# Altium schematic sheet CFD.SchDoc: FMC_ADC
size 420 x 297 mm; Author: G.Kasprowicz; CompanyName: WUT ISE; DrawnBy: G.Kasprowicz; Organization: WUT ISE; Address1: PW ISE; Address2: Nowowiejska 15/19 00-665 Warsaw; Address3: gkasprow@gmail.com; DocumentNumber: 3; Revision: 2; SheetNumber: 3; SheetTotal: 12; ModifiedBy: -; CheckedDate: -; Title2: CFD, ADC driver; DivGrp: WUT ISE; Designer: G.Kasprowicz; ModifiedDate: -; ProjectName: Sensor Box
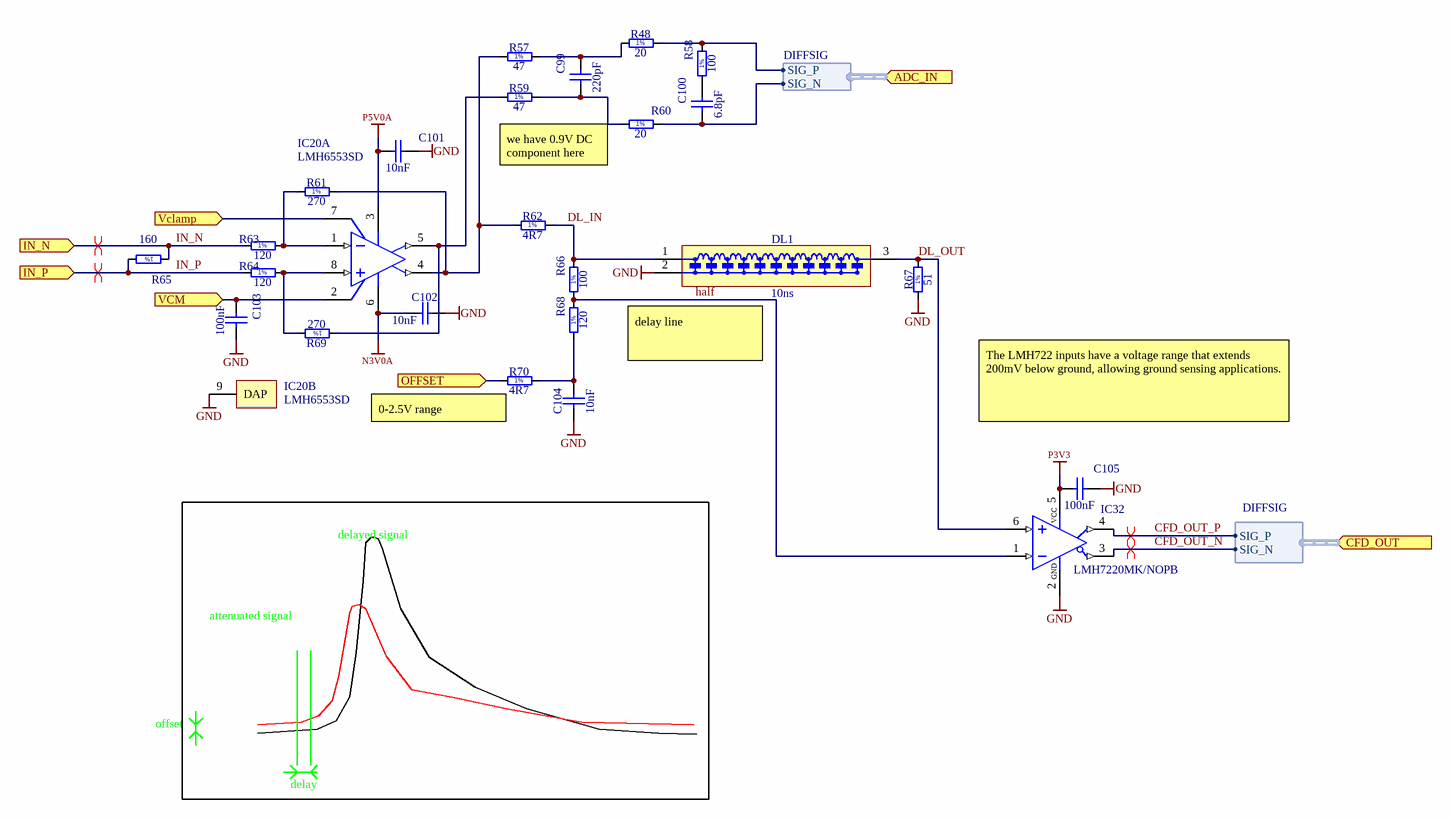
[diagram p0: CFD.SchDoc]

## Parts
C99  220pF  [CAPC1005X55N]
C100  6.8pF  [CAPC1005X70N]
C101  10nF  [CAPC0603X33N]
C102  10nF  [CAPC0603X33N]
C103  100nF  [CAPC0603X33N]
C104  10nF  [CAPC1005X55N]
C105  100nF  [CAPC0603X33N]
DL1  10ns  [DS1L]
IC20  LMH6553SD  [SDA08C]  (parts A,B of 2)
IC32  LMH7220MK/NOPB  [SOT95P285X100-6N]
R48  20  [RESC1005X40N]
R57  47  [RESC1005X40N]
R58  100  [RESC0603X28N]
R59  47  [RESC1005X40N]
R60  20  [RESC1005X40N]
R61  270  [RESC1005X40N]
R62  4R7  [RESC1005X40N]
R63  120  [RESC1005X40N]
R64  120  [RESC1005X40N]
R65  160  [RESC1005X40N]
R66  100  [RESC0603X28N]
R67  51  [RESC1005X40N]
R68  120  [RESC1005X40N]
R69  270  [RESC1005X40N]
R70  4R7  [RESC1005X40N]

## Ports
ADC_IN (in, harness DIFFSIG), CFD_OUT (in, harness DIFFSIG), IN_N (in), IN_P (in), OFFSET (in), Vclamp (in), VCM (in)

## Harnesses
DIFFSIG: SIG_P, SIG_N

## Nets
GND: C101.2 C102.2 C103.2 C104.1 C105.2 DL1.2(IN) IC20.9(DAP) IC32.2(GND) R67.1
N3V0A: C102.1 IC20.6(V-)
P3V3: C105.1 IC32.5(VCC)
P5V0A: C101.1 IC20.3(V+)
CFD_OUT_N: IC32.3(VOUT~{Q}) ; port CFD_OUT.SIG_N
CFD_OUT_P: IC32.4(VOUTQ) ; port CFD_OUT.SIG_P
DL_IN: DL1.1(GND) R62.2 R66.2
DL_OUT: DL1.3(OUT) IC32.6(IN+) R67.2
half: IC32.1(IN-) R66.1 R68.2
IN_N: R63.1 R65.1 ; port IN_N
IN_P: R64.1 R65.2 ; port IN_P
OFFSET: R70.1 ; port OFFSET
Vclamp: IC20.7(VCLAMP) ; port Vclamp
VCM: C103.1 IC20.2(VCM) ; port VCM
NetC99_1: C99.1 R59.2 R60.1
NetC99_2: C99.2 R48.1 R57.2
NetC100_1: C100.1 R60.2 ; port ADC_IN.SIG_N
NetC100_2: C100.2 R58.1
NetC104_2: C104.2 R68.1 R70.2
NetIC20_1: IC20.1(IN-) R61.1 R63.2
NetIC20_4: IC20.4(OUT+) R57.1 R61.2 R62.1
NetIC20_5: IC20.5(OUT-) R59.1 R69.1
NetIC20_8: IC20.8(IN+) R64.2 R69.2
NetR48_2: R48.2 R58.2 ; port ADC_IN.SIG_P

## Layout directives
differential pair: CFD_OUT_N, CFD_OUT_P, IN_N, IN_P

## Notes on the sheet
- we have 0.9V DC component here
- delay line
- (near R70) 0-2.5V range
- The LMH722 inputs have a voltage range that extends  200mV below ground, allowing ground sensing applications.
- delayed signal
- attenuated signal
- offset
- delay
- Project/Equipment
- Document
- Designer
- Drawn by
- Check.by
- Copyright WUT ISE 2018.
  This documentation describes Open Hardware and is licensed under the CERN OHL v.1.1. You may redistribute and modify this documentation under the terms of the CERN OHL v.1.1. (http://ohwr.org/CERNOHL). This documentation is distributed WITHOUT ANY EXPRESS OR IMPLIED WARRANTY, INCLUDING OF MERCHANTABILITY, SATISFACTORY QUALITY AND FITNESS FOR A PARTICULAR PURPOSE. Please see the CERN OHL v.1.1 for applicable conditions.
- Contact
- File
- Last Mod.
- Print Date
- Sheet
- Size
- A3
- of
- Rev
- (in symbol R0201_100R_1%_0.05W_200PPM) 1%
- (in symbol R0402_4R7_1%_0.0625W_200PPM) 1%
- (in symbol R0402_20R_1%_0.0625W_100PPM) 1%
- (in symbol R0402_47R_1%_0.0625W_100PPM) 1%
- (in symbol R0402_51R_1%_0.0625W_100PPM) 1%
- (in symbol R0402_120R_1%_0.0625W_100PPM) 1%
- (in symbol R0402_160R_1%_0.0625W_100PPM) 1%
- (in symbol R0402_270R_1%_0.0625W_100PPM) 1%

## Library data of the parts
C99 = CC0402_220PF_50V_5%_C0G: Non-polarised capacitor; Part Description: SMD Multilayer Chip Ceramic Capacitor; Manufacturer: GENERIC; Manufacturer1 Part Number: C0402C221J5GACTU; Voltage: 50V; TC: C0G/NP0; Tolerance: ±5%; Part Number: CC0402_220PF_50V_5%_C0G; Component Kind: Standard; Component Type: Standard; Pin Count: 2; Value: 220pF; Status: Preferred; Manufacturer Part Number: CC0402_220PF_50V_5%_C0G; Case: 0402; Mounted: Yes; Socket: No; SMD: Yes; Sense: No; Manufacturer1 ComponentHeight: 0.55mm; HelpURL: \\cern.ch\dfs\Applications\Altium\Datasheets\CC0805_C0G_KEMET_(Commercial Grade).pdf; Author: CERN DEM JLC; CreateDate: 03.12.2007; LatestRevisionDate: 22.04.2015; Manufacturer1 Example: KEMET
C100 = CC0402_6.8PF_50V_0.25PF_C0G_VISHAY_VJ_NON-MAGNETIC: Non-polarised capacitor; Part Description: Surface Mount Multilayer Ceramic Chip Capacitors for Non-Magnetic Applications (IR Reflow Soldering); Manufacturer: VISHAY VITRAMON; Manufacturer Part Number: VJ0402A6R8CCAA; Voltage: 50V; TC: C0G/NP0; Tolerance: ±0.25pF; Part Number: CC0402_6.8PF_50V_0.25PF_C0G_VISHAY_VJ_NON-MAGNETIC; Component Kind: Standard; Component Type: Standard; Pin Count: 2; Value: 6.8pF; Status: Not Recommended; Case: 0402; Mounted: Yes; Socket: No; SMD: Yes; Sense: No; ComponentHeight: 0.64mm; HelpURL: \\cern.ch\dfs\Applications\Altium\Datasheets\CC0402_VISHAY_VJ_NON-MAGNETIC.pdf; Author: CERN DEM MR; CreateDate: 22.06.2016; LatestRevisionDate: 03.03.2017
C101 C102 = CC0201_10NF_10V_10%_X5R: Non-polarised capacitor; Part Description: SMD Multilayer Chip Ceramic Capacitor; Manufacturer: GENERIC; Manufacturer1 Part Number: 0201ZD103KAT2A; Voltage: 10V; TC: X5R; Tolerance: ±10%; Part Number: CC0201_10NF_10V_10%_X5R; Component Kind: Standard; Component Type: Standard; Pin Count: 2; Value: 10nF; Status: Not Recommended; Manufacturer Part Number: CC0201_10NF_10V_10%_X5R; Case: 0201; Mounted: Yes; Socket: No; SMD: Yes; Sense: No; Manufacturer1 Example: AVX; Manufacturer1 ComponentHeight: 0.33mm; HelpURL: \\cern.ch\dfs\Applications\Altium\Datasheets\CC0201_X5R_AVX.pdf; Author: CERN DEM JLC; CreateDate: 03.12.2007; LatestRevisionDate: 03.12.2007
C103 C105 = CC0201_100NF_6.3V_10%_X5R: Non-polarised capacitor; Part Description: SMD Multilayer Chip Ceramic Capacitor; Manufacturer: GENERIC; Manufacturer1 Part Number: 02016D104KAT2A; Voltage: 6.3V; TC: X5R; Tolerance: ±10%; Part Number: CC0201_100NF_6.3V_10%_X5R; Component Kind: Standard; Component Type: Standard; Pin Count: 2; Value: 100nF; Status: Not Recommended; Manufacturer Part Number: CC0201_100NF_6.3V_10%_X5R; Case: 0201; Mounted: Yes; Socket: No; SMD: Yes; Sense: No; Manufacturer1 Example: AVX; Manufacturer1 ComponentHeight: 0.33mm; HelpURL: \\cern.ch\dfs\Applications\Altium\Datasheets\CC0201_X5R_AVX.pdf; Author: CERN DEM JLC; CreateDate: 03.12.2007; LatestRevisionDate: 03.12.2007
C104 = CC0402_10NF_16V_10%_X7R: Non-polarised capacitor; Part Description: SMD Multilayer Chip Ceramic Capacitor; Manufacturer: GENERIC; Manufacturer1 Part Number: 223878715636; Voltage: 16V; TC: X7R; Tolerance: ±10%; Part Number: CC0402_10NF_16V_10%_X7R; Component Kind: Standard; Component Type: Standard; Pin Count: 2; Value: 10nF; Status: Not Recommended; Manufacturer Part Number: CC0402_10NF_16V_10%_X7R; Case: 0402; Mounted: Yes; Socket: No; SMD: Yes; Sense: No; Manufacturer1 Example: PHYCOMP; Manufacturer1 ComponentHeight: 0.55mm; HelpURL: \\cern.ch\dfs\Applications\Altium\Datasheets\CC0402_X7R_PHYCOMP.pdf; Author: CERN DEM JLC; CreateDate: 03.12.2007; LatestRevisionDate: 03.12.2007
DL1 = DL_DS1L: Fixed SIP Delay Line; Part Description: 50 Ohm Fixed SIP Delay Line; Resistance: ± 1.0ns; Part Number: DS1L; Component Kind: Standard; Component Type: Standard; Pin Count: 2; Value: 10ns; Manufacturer: DS1L; Manufacturer Part Number: DS1L; Mounted: Yes; Socket: No; SMD: No; Sense: No; ComponentHeight: 9.2; HelpURL: \\cern.ch\dfs\Applications\Altium\Datasheets\DL_DATA-DELAY-DEVICES_1513.pdf; Author: GK; CreateDate: 07.05.2012; LatestRevisionDate: 07.05.2012
IC20 = CMP-0055-00983-1: 900 MHz Fully Differential Amplifier with Output Limiting Clamp, 8-pin LLP; Manufacturer: National Semiconductor; CompType: Amplifiers; PowerWise: Y; PackageTopMarking: XYTT*6553; PackageVersion: revA, Jan-2004; PackageDescription: LLP, Plastic, Dual, 2.5 x 3.0 x 0.8mm Body, 8 Lead, 0.5mm Pitch, No Pullback; PinCount: 8; PackageReference: SDA08C; DatasheetVersion: Nov-2008; RoHS: Y
IC32 = LMH7220MK/NOPB: High Speed Comparator with LVDS Output; Manufacturer: NATIONAL SEMICONDUCTOR; PressFit: No; Bonding: No; Part Number: LMH7220MK/NOPB; Component Kind: Standard; Component Type: Standard; Device: LMH7220MK/NOPB; PackageDescription: 0.95mm, pitch; 6 pin, 1.65mm W X 2.97mm L X 1.00mm H body IPC Medium Density; Part Description: High Speed Comparator with LVDS Output; Manufacturer Part Number: LMH7220MK/NOPB; Pin Count: 6; Case: SOT23-6; Mounted: Yes; Socket: No; SMD: Yes; Sense: No; ComponentHeight: 1mm; Author: CERN DEM JLC; HelpURL: \\cern.ch\dfs\Applications\Altium\Datasheets\LMH7220MK-NOPB.pdf; CreateDate: 30.03.2010; LatestRevisionDate: 30.03.2010
R48 R60 = R0402_20R_1%_0.0625W_100PPM: Resistor - 1%; Part Description: General Purpose Thick Film Chip Resistor; Manufacturer: GENERIC; Manufacturer1 Part Number: 232270672009L; TC: ±100ppm/°C; PressFit: No; Part Number: R0402_20R_1%_0.0625W_100PPM; Component Kind: Standard; Component Type: Standard; Pin Count: 2; Value: 20; Status: Not Recommended; Power: 0.0625W; Tolerance: ±1%; Manufacturer Part Number: R0402_20R_1%_0.0625W_100PPM; Case: 0402; Mounted: Yes; Sense: No; Socket: No; SMD: Yes; Manufacturer1 Example: YAGEO PHYCOMP; Manufacturer1 ComponentHeight: 0.4mm; HelpURL: \\cern.ch\dfs\Applications\Altium\Datasheets\R0402_Phycomp_RC0402.pdf; Author: CERN DEM JLC; CreateDate: 03.12.2007; LatestRevisionDate: 17.10.2012
R57 R59 = R0402_47R_1%_0.0625W_100PPM: Resistor - 1%; Part Description: General Purpose Thick Film Chip Resistor; Manufacturer: GENERIC; Manufacturer1 Part Number: 232270674709L; TC: ±100ppm/°C; PressFit: No; Part Number: R0402_47R_1%_0.0625W_100PPM; Component Kind: Standard; Component Type: Standard; Pin Count: 2; Value: 47; Status: Not Recommended; Power: 0.0625W; Tolerance: ±1%; Manufacturer Part Number: R0402_47R_1%_0.0625W_100PPM; Case: 0402; Mounted: Yes; Sense: No; Socket: No; SMD: Yes; Manufacturer1 Example: YAGEO PHYCOMP; Manufacturer1 ComponentHeight: 0.4mm; HelpURL: \\cern.ch\dfs\Applications\Altium\Datasheets\R0402_Phycomp_RC0402.pdf; Author: CERN DEM JLC; CreateDate: 03.12.2007; LatestRevisionDate: 17.10.2012
R58 R66 = R0201_100R_1%_0.05W_200PPM: Resistor - 1%; Part Description: Thick Film Chip Resistor; Manufacturer: GENERIC; Manufacturer1 Part Number: CRCW0201100RFNED; Power: 0.05W; TC: ±200ppm/°C; PressFit: No; Part Number: R0201_100R_1%_0.05W_200PPM; Component Kind: Standard; Component Type: Standard; Pin Count: 2; Value: 100; Status: Not Recommended; Tolerance: ±1%; Manufacturer Part Number: R0201_100R_1%_0.05W_200PPM; Case: 0201; Mounted: Yes; Sense: No; Socket: No; SMD: Yes; Manufacturer1 Example: VISHAY; Manufacturer1 ComponentHeight: 0.27mm; HelpURL: \\cern.ch\dfs\Applications\Altium\Datasheets\R0201_VISHAY_CRCW0201 e3.pdf; Author: CERN DEM JLC; CreateDate: 13.11.2014; LatestRevisionDate: 13.11.2014
R61 R69 = R0402_270R_1%_0.0625W_100PPM: Resistor - 1%; Part Description: General Purpose Thick Film Chip Resistor; Manufacturer: GENERIC; Manufacturer1 Part Number: 232270672701L; TC: ±100ppm/°C; PressFit: No; Part Number: R0402_270R_1%_0.0625W_100PPM; Component Kind: Standard; Component Type: Standard; Pin Count: 2; Value: 270; Status: Not Recommended; Power: 0.0625W; Tolerance: ±1%; Manufacturer Part Number: R0402_270R_1%_0.0625W_100PPM; Case: 0402; Mounted: Yes; Sense: No; Socket: No; SMD: Yes; Manufacturer1 Example: YAGEO PHYCOMP; Manufacturer1 ComponentHeight: 0.4mm; HelpURL: \\cern.ch\dfs\Applications\Altium\Datasheets\R0402_Phycomp_RC0402.pdf; Author: CERN DEM JLC; CreateDate: 03.12.2007; LatestRevisionDate: 17.10.2012
R62 R70 = R0402_4R7_1%_0.0625W_200PPM: Resistor - 1%; Part Description: General Purpose Thick Film Chip Resistor; Manufacturer: GENERIC; Manufacturer1 Part Number: 232270674708L; TC: ±200ppm/°C; PressFit: No; Part Number: R0402_4R7_1%_0.0625W_200PPM; Component Kind: Standard; Component Type: Standard; Pin Count: 2; Value: 4R7; Status: Not Recommended; Power: 0.0625W; Tolerance: ±1%; Manufacturer Part Number: R0402_4R7_1%_0.0625W_200PPM; Case: 0402; Mounted: Yes; Sense: No; Socket: No; SMD: Yes; Manufacturer1 Example: YAGEO PHYCOMP; Manufacturer1 ComponentHeight: 0.4mm; HelpURL: \\cern.ch\dfs\Applications\Altium\Datasheets\R0402_Phycomp_RC0402.pdf; Author: CERN DEM JLC; CreateDate: 03.12.2007; LatestRevisionDate: 17.10.2012
R63 R64 R68 = R0402_120R_1%_0.0625W_100PPM: Resistor - 1%; Part Description: General Purpose Thick Film Chip Resistor; Manufacturer: GENERIC; Manufacturer1 Part Number: 232270671201L; TC: ±100ppm/°C; PressFit: No; Part Number: R0402_120R_1%_0.0625W_100PPM; Component Kind: Standard; Component Type: Standard; Pin Count: 2; Value: 120; Status: Not Recommended; Power: 0.0625W; Tolerance: ±1%; Manufacturer Part Number: R0402_120R_1%_0.0625W_100PPM; Case: 0402; Mounted: Yes; Sense: No; Socket: No; SMD: Yes; Manufacturer1 Example: YAGEO PHYCOMP; Manufacturer1 ComponentHeight: 0.4mm; HelpURL: \\cern.ch\dfs\Applications\Altium\Datasheets\R0402_Phycomp_RC0402.pdf; Author: CERN DEM JLC; CreateDate: 03.12.2007; LatestRevisionDate: 17.10.2012
R65 = R0402_160R_1%_0.0625W_100PPM: Resistor - 1%; Part Description: General Purpose Thick Film Chip Resistor; Manufacturer: GENERIC; Manufacturer1 Part Number: 232270671601L; TC: ±100ppm/°C; PressFit: No; Part Number: R0402_160R_1%_0.0625W_100PPM; Component Kind: Standard; Component Type: Standard; Pin Count: 2; Value: 160; Status: Not Recommended; Power: 0.0625W; Tolerance: ±1%; Manufacturer Part Number: R0402_160R_1%_0.0625W_100PPM; Case: 0402; Mounted: Yes; Sense: No; Socket: No; SMD: Yes; Manufacturer1 Example: YAGEO PHYCOMP; Manufacturer1 ComponentHeight: 0.4mm; HelpURL: \\cern.ch\dfs\Applications\Altium\Datasheets\R0402_Phycomp_RC0402.pdf; Author: CERN DEM JLC; CreateDate: 03.12.2007; LatestRevisionDate: 17.10.2012
R67 = R0402_51R_1%_0.0625W_100PPM: Resistor - 1%; Part Description: General Purpose Thick Film Chip Resistor; Manufacturer: GENERIC; Manufacturer1 Part Number: 232270675109L; TC: ±100ppm/°C; PressFit: No; Part Number: R0402_51R_1%_0.0625W_100PPM; Component Kind: Standard; Component Type: Standard; Pin Count: 2; Value: 51; Status: Not Recommended; Power: 0.0625W; Tolerance: ±1%; Manufacturer Part Number: R0402_51R_1%_0.0625W_100PPM; Case: 0402; Mounted: Yes; Sense: No; Socket: No; SMD: Yes; Manufacturer1 Example: YAGEO PHYCOMP; Manufacturer1 ComponentHeight: 0.4mm; HelpURL: \\cern.ch\dfs\Applications\Altium\Datasheets\R0402_Phycomp_RC0402.pdf; Author: CERN DEM JLC; CreateDate: 03.12.2007; LatestRevisionDate: 17.10.2012